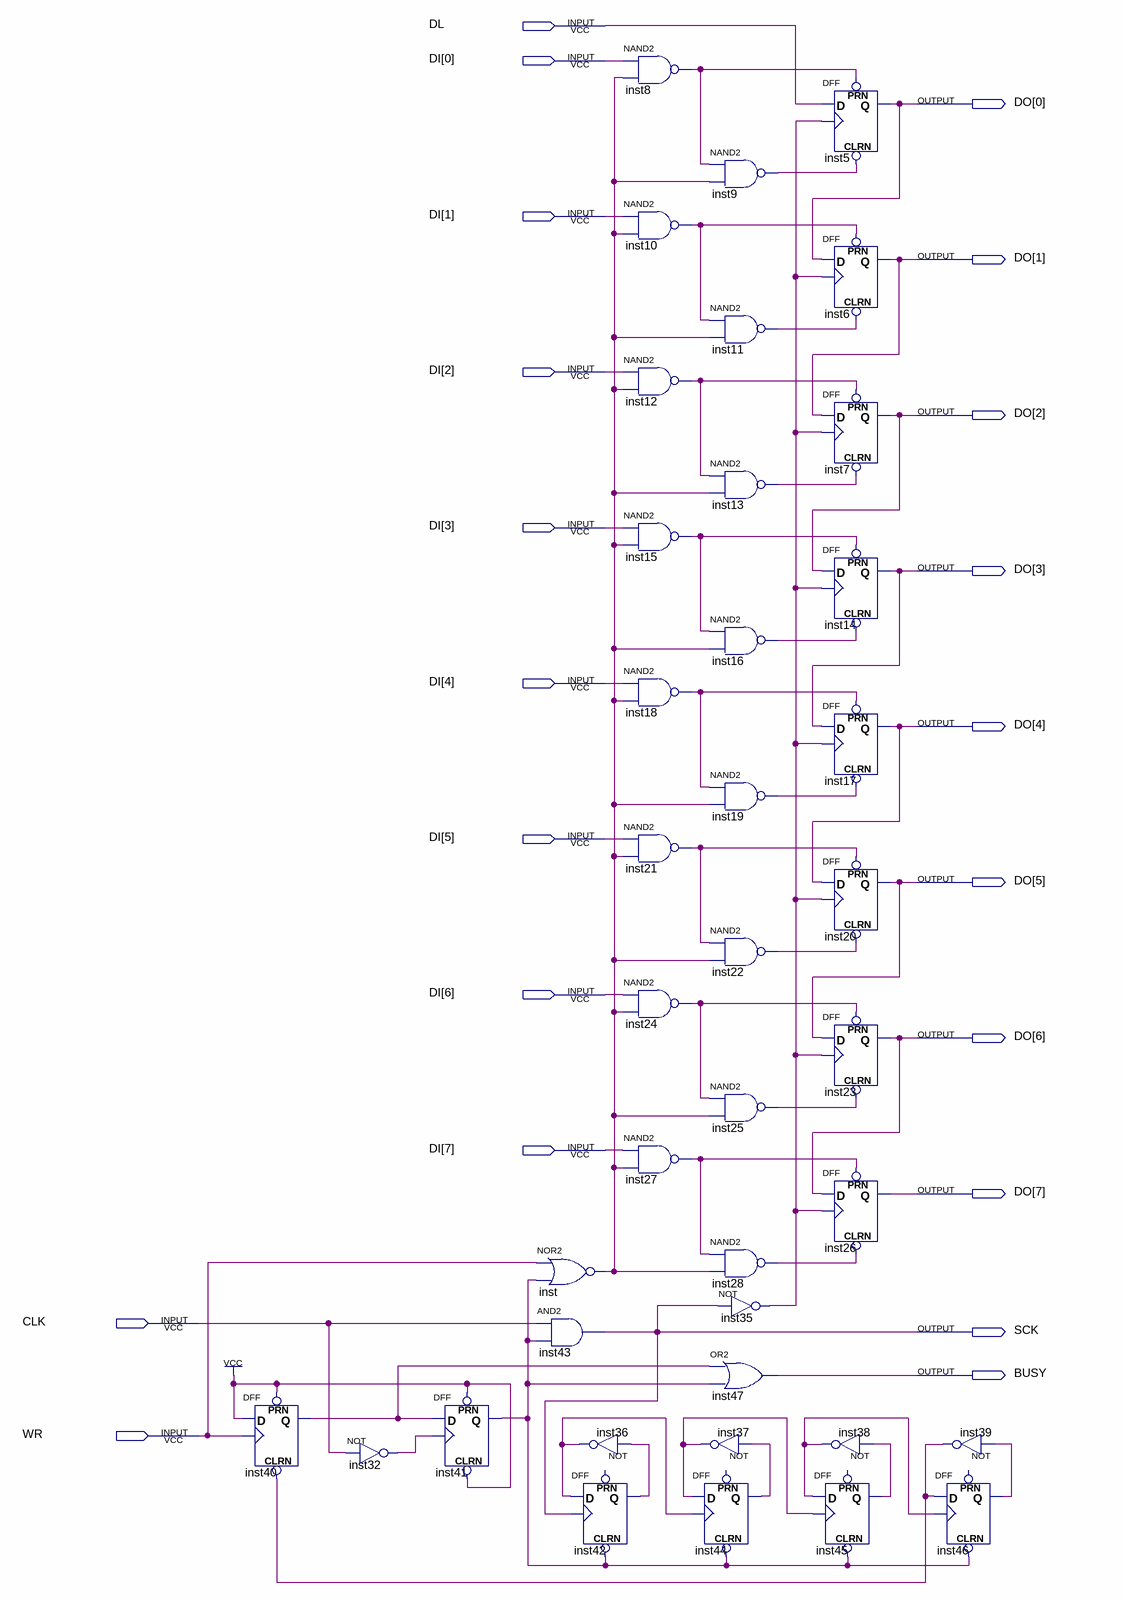
[diagram p0: schematic sheet]
// Quartus schematic SPIReg.bdf as structural Verilog: 39 symbols, 21 pins
module SPIReg (
  input  DL,
  input  [7:0] DI,
  input  CLK,
  input  WR,
  output [7:0] DO,
  output SCK,
  output BUSY
);

  wire inst8_out, inst9_out, inst10_out, inst11_out, inst12_out, inst13_out, inst15_out, inst16_out,
       inst18_out, inst19_out, inst21_out, inst22_out, inst24_out, inst25_out, inst27_out, inst28_out,
       inst32_out, inst35_out, inst36_out, inst37_out, inst38_out, inst39_out, inst40_q, inst41_q, inst42_q,
       inst44_q, inst45_q, inst46_q, inst_out;

  DFF inst40 (.CLRN(inst39_out), .CLK(WR), .D(1'b1), .PRN(1'b1), .Q(inst40_q));
  not inst32 (inst32_out, CLK);
  DFF inst41 (.CLRN(1'b1), .CLK(inst32_out), .D(inst40_q), .PRN(1'b1), .Q(inst41_q));
  nor inst (inst_out, WR, inst41_q);
  and inst43 (SCK, CLK, inst41_q);
  not inst36 (inst36_out, inst42_q);
  DFF inst42 (.CLRN(inst41_q), .CLK(SCK), .D(inst36_out), .Q(inst42_q));  // open: PRN
  nand inst8 (inst8_out, DI[0], inst_out);
  nand inst10 (inst10_out, DI[1], inst_out);
  nand inst12 (inst12_out, DI[2], inst_out);
  nand inst15 (inst15_out, DI[3], inst_out);
  nand inst18 (inst18_out, DI[4], inst_out);
  nand inst21 (inst21_out, DI[5], inst_out);
  nand inst24 (inst24_out, DI[6], inst_out);
  nand inst27 (inst27_out, DI[7], inst_out);
  nand inst9 (inst9_out, inst8_out, inst_out);
  nand inst11 (inst11_out, inst10_out, inst_out);
  nand inst13 (inst13_out, inst12_out, inst_out);
  nand inst16 (inst16_out, inst15_out, inst_out);
  nand inst19 (inst19_out, inst18_out, inst_out);
  nand inst22 (inst22_out, inst21_out, inst_out);
  nand inst25 (inst25_out, inst24_out, inst_out);
  nand inst28 (inst28_out, inst27_out, inst_out);
  not inst35 (inst35_out, SCK);
  or inst47 (BUSY, inst40_q, inst41_q);
  not inst37 (inst37_out, inst44_q);
  DFF inst44 (.CLRN(inst41_q), .CLK(inst36_out), .D(inst37_out), .Q(inst44_q));  // open: PRN
  DFF inst45 (.CLRN(inst41_q), .CLK(inst37_out), .D(inst38_out), .Q(inst45_q));  // open: PRN
  DFF inst5 (.CLRN(inst9_out), .CLK(inst35_out), .D(DL), .PRN(inst8_out), .Q(DO[0]));
  DFF inst6 (.CLRN(inst11_out), .CLK(inst35_out), .D(DO[0]), .PRN(inst10_out), .Q(DO[1]));
  DFF inst7 (.CLRN(inst13_out), .CLK(inst35_out), .D(DO[1]), .PRN(inst12_out), .Q(DO[2]));
  DFF inst14 (.CLRN(inst16_out), .CLK(inst35_out), .D(DO[2]), .PRN(inst15_out), .Q(DO[3]));
  DFF inst17 (.CLRN(inst19_out), .CLK(inst35_out), .D(DO[3]), .PRN(inst18_out), .Q(DO[4]));
  DFF inst20 (.CLRN(inst22_out), .CLK(inst35_out), .D(DO[4]), .PRN(inst21_out), .Q(DO[5]));
  DFF inst23 (.CLRN(inst25_out), .CLK(inst35_out), .D(DO[5]), .PRN(inst24_out), .Q(DO[6]));
  DFF inst26 (.CLRN(inst28_out), .CLK(inst35_out), .D(DO[6]), .PRN(inst27_out), .Q(DO[7]));
  not inst38 (inst38_out, inst45_q);
  not inst39 (inst39_out, inst46_q);
  DFF inst46 (.CLRN(inst41_q), .CLK(inst38_out), .D(inst39_out), .Q(inst46_q));  // open: PRN
endmodule
